# Altium project MB1397.PrjPcb (part 8 of 9)

## Sheet RS232&RS485.SchDoc: RS232 & RS485
size A4; Date: Not used; ApprovedBy: Not used; CheckedBy: Not used; Author: Not used; CompanyName: STMicroelectronics; DrawnBy: Not used; Engineer: Not used; Organization: Not used; Address1: Not used; Address2: Not used; Address3: Not used; Address4: Not used; DocumentNumber: Not used; Revision: Not used; SheetNumber: 11; SheetTotal: 22; CurrentTime: Not used; CurrentDate: Not used; Time: Not used; DocumentFullPathAndName: Not used; DocumentName: Not used; ModifiedDate: Not used; ImagePath: Not used; ProjectName: Not used; Application_BuildNumber: Not used
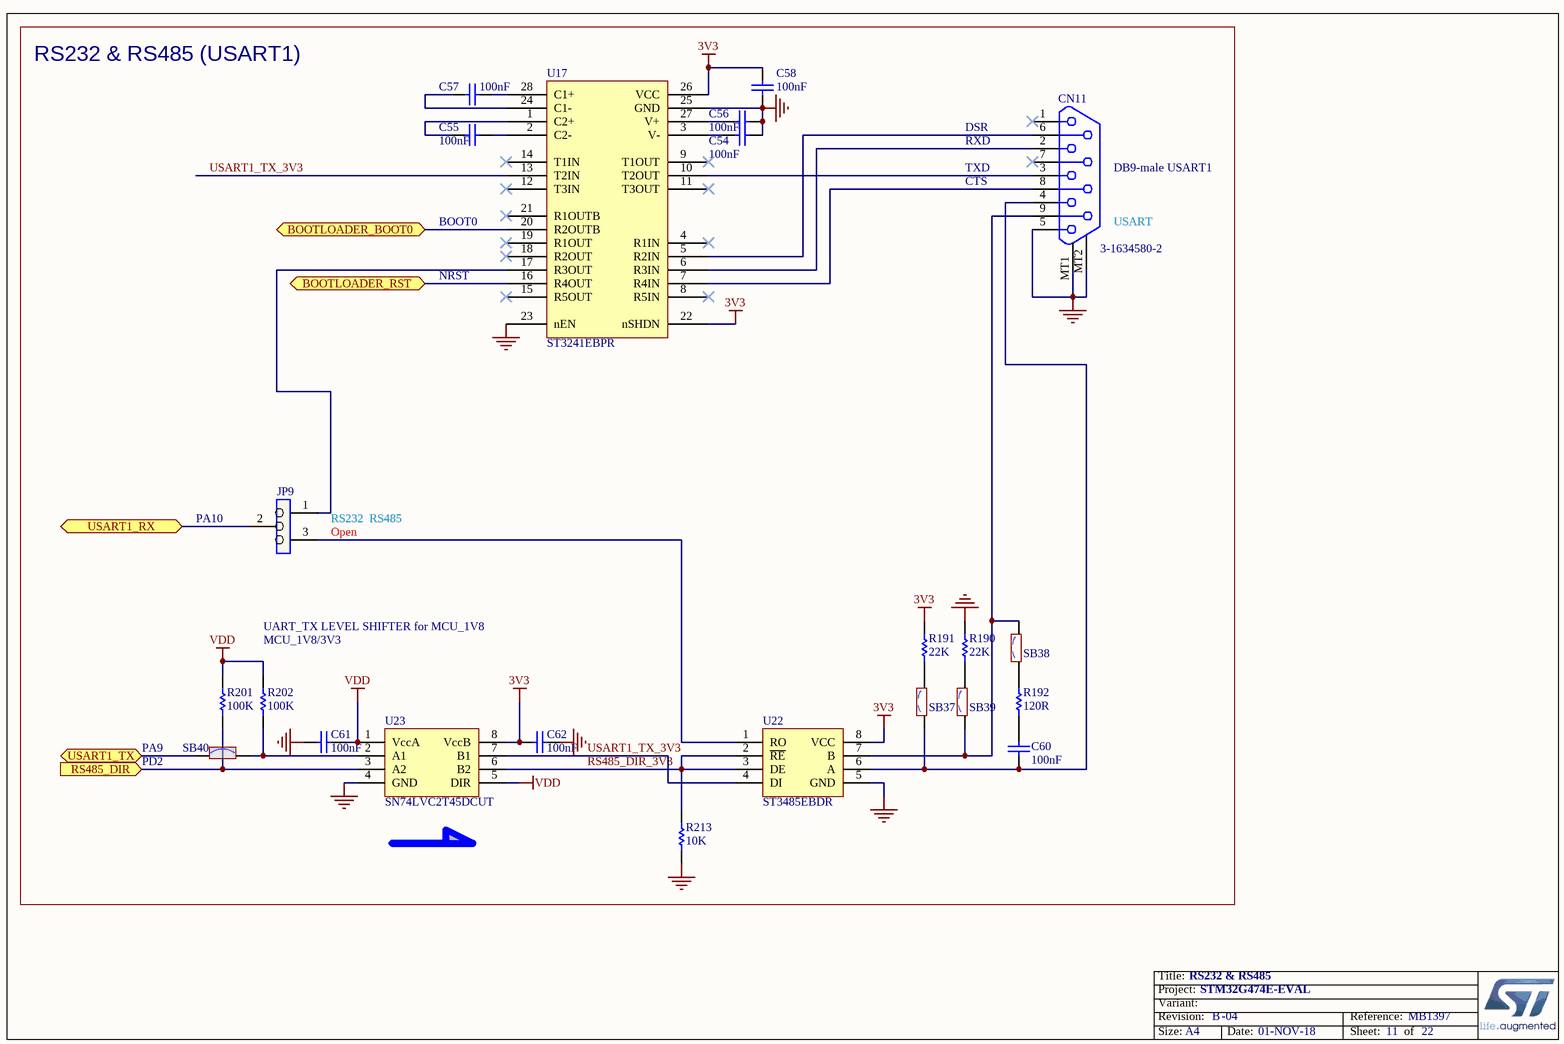
[diagram p20: RS232&RS485.SchDoc]

### Parts
C54  value 100nF  [C0402]  (hidden comment: Capacitor)
C55  value 100nF  [C0402]  (hidden comment: Capacitor)
C56  value 100nF  [C0402]  (hidden comment: Capacitor)
C57  value 100nF  [C0402]  (hidden comment: Capacitor)
C58  value 100nF  [C0402]  (hidden comment: Capacitor)
C60  value 100nF  [C0603]  (hidden comment: Capacitor)
C61  value 100nF  [C0603]  (hidden comment: Capacitor)
C62  value 100nF  [C0603]  (hidden comment: Capacitor)
CN11  value 3-1634580-2  [CON_DB9-MALE_TYCO_3-1634580-2]  (hidden comment: DB9_Header_male_3-1634580-2)
JP9  Jumper_Header 3x1  [CON_SAMTEC_TSW-103-07-F-S]  (value not drawn)
R190  value 22K  [R0603]  (hidden comment: Resistor)
R191  value 22K  [R0603]  (hidden comment: Resistor)
R192  value 120R  [R0603]  (hidden comment: Resistor)
R201  value 100K  [R0603]  (hidden comment: Resistor)
R202  value 100K  [R0603]  (hidden comment: Resistor)
R213  value 10K  [R0603]  (hidden comment: Resistor)
SB37  SB_OFF  [SOLDER-BRIDGE_R0603-0R]  (value not drawn)
SB38  SB_OFF  [SOLDER-BRIDGE_R0603-0R]  (value not drawn)
SB39  SB_OFF  [SOLDER-BRIDGE_R0603-0R]  (value not drawn)
SB40  SB_ON  [SOLDER-BRIDGE_R0603-0R]  (value not drawn)
U17  ST3241EBPR  [ICC_SSOP28_10P2X5P3_P065]
U22  ST3485EBDR  [ICC_SO8_5X4_P127]
U23  SN74LVC2T45DCUT  [ICC_VSSOP8_DCU_R-PDSO-G8_2X2P30_P050]

### Ports
BOOTLOADER_BOOT0, BOOTLOADER_RST, RS485_DIR (in), USART1_RX, USART1_TX

### Nets
3V3: C58.1 C62.2 R191.1 U17.22(nSHDN) U17.26(VCC) U22.8(VCC) U23.8(VccB)
GND: C54.1 C56.1 C58.2 C61.2 C62.1 CN11.5 CN11.MT1 CN11.MT2 R190.2 R213.1 U17.23(nEN) U17.25(GND) U22.5(GND) U23.4(GND)
VDD: C61.1 R201.2 R202.2 U23.1(VccA) U23.5(DIR)
RS485_DIR: R201.1 U23.3(A2) ; port RS485_DIR
RS485_DIR_3V3: R213.2 U22.2(~{RE}) U22.3(DE) U23.6(B2)
USART1_RX: JP9.2 ; port USART1_RX
USART1_TX: SB40.1 ; port USART1_TX
USART1_TX_3V3: U17.13(T2IN) U22.4(DI) U23.7(B1)
NetC54_2: C54.2 U17.3(V-)
NetC55_1: C55.1 U17.1(C2+)
NetC55_2: C55.2 U17.2(C2-)
NetC56_2: C56.2 U17.27(V+)
NetC57_1: C57.1 U17.24(C1-)
NetC57_2: C57.2 U17.28(C1+)
NetC60_1: C60.1 CN11.4 SB37.1 U22.6(A)
NetC60_2: C60.2 R192.1
NetCN11_2: CN11.2 U17.6(R3IN)
NetCN11_3: CN11.3 U17.10(T2OUT)
NetCN11_6: CN11.6 U17.5(R2IN)
NetCN11_8: CN11.8 U17.7(R4IN)
NetCN11_9: CN11.9 SB38.2 SB39.1 U22.7(B)
NetD2_1: U17.20(R2OUTB) ; port BOOTLOADER_BOOT0
NetJP9_1: JP9.1 U17.17(R3OUT)
NetJP9_3: JP9.3 U22.1(RO)
NetJP18_2: U17.16(R4OUT) ; port BOOTLOADER_RST
NetR190_1: R190.1 SB39.2
NetR191_2: R191.2 SB37.2
NetR192_2: R192.2 SB38.1
NetR202_1: R202.1 SB40.2 U23.2(A1)

Not connected (* = marked no-connect by the designer): CN11 1* 7*; U17 4(R1IN)* 8(R5IN)* 9(T1OUT)* 11(T3OUT)* 12(T3IN)* 14(T1IN)* 15(R5OUT)* 18(R2OUT)* 19(R1OUT)* 21(R1OUTB)*

### Notes on the sheet
- RS232 & RS485 (USART1)
- RXD
- TXD
- CTS
- DSR
- (near CN11) DB9-male USART1
- BOOT0
- (near CN11) USART
- NRST
- PA10
- (near JP9) RS232  RS485
- (near JP9) Open
- UART_TX LEVEL SHIFTER for MCU_1V8
- MCU_1V8/3V3
- PA9
- PD2
- Title:
- Project:
- Size:
- Revision:
- Variant:
- A4
- -
- Date:
- Reference:
- Sheet:
- of

### Library data of the parts
C54-C58 = MCD-00006: as C157 on sheet Peripherals; Internal_Part_Number: MCD-00006; ComponentLink1Description: Datasheet; Status: Released; Package: C0402; Part_Type: Capacitor; ComponentLink1URL: http://tunmcdsvn.tun.st.com/Component_Datasheet_Library/Trunk/Capacitors/Yageo_Multilayer_Capacitor_X7R_series_100pF_to_22uF
C60-C62 = MCD-00211: as C13 on sheet Peripherals; Internal_Part_Number: MCD-00211; ComponentLink1Description: Datasheet; Status: Released; Part_Type: Capacitor; Package: C0603; ComponentLink1URL: http://tunmcdsvn.tun.st.com/Component_Datasheet_Library/Trunk/Capacitors/Yageo_Multilayer_Capacitor_X7R_series_100pF_to_22uF
CN11 = MCD-00127: Header, DB9, RA, TH, Height 13.57mm; Manufacturer: TYCO; Part_Type: Connector; Provided_By: SUBCO; Initial_Board_Reference: MB1262; Path: ws/MCD_ApplicationBoards/Lists/MCDPARTSdatabase; Item Type: Item; Internal_Part_Number: MCD-00127; Manufacturer_Part_Number: 3-1634580-2; ComponentLink1Description: Datasheet; Status: Released; ComponentLink1URL: http://tunmcdsvn.tun.st.com/Component_Datasheet_Library/Trunk/Connectors/Tyco_DB9_3-1634580-2_footprint
JP9 = MCD-00111: as JP14 on sheet USB_PD; Internal_Part_Number: MCD-00111; Value: Header 3x1; Status: Released; ComponentLink1Description: Datasheet; ComponentLink1URL: http://tunmcdsvn.tun.st.com/Component_Datasheet_Library/Trunk/Connectors/Samtec_TSW-HTSW-series
R190 R191 = MCD-00430: Resistor,22K,0603,1%,1/10W; Manufacturer_Part_Number: RC0603FR-0722KL; Manufacturer: YAGEO; Provided_By: SUBCO; Initial_Board_Reference: MBxxxx; Path: ws/MCD_ApplicationBoards/Lists/MCDPARTSdatabase; Item Type: Item; Internal_Part_Number: MCD-00430; Status: Released; Part_Type: Resistor; Package: R0603; ComponentLink1Description: Datasheet; ComponentLink1URL: http://tunmcdsvn.tun.st.com/Component_Datasheet_Library/Trunk/Resistors/Yageo_Resistor_RC0603-series
R192 = MCD-00338: Resistor,120R,0603,1%,1/10W; Manufacturer_Part_Number: RC0603FR-07120RL; Manufacturer: YAGEO; BMS_Part_Number: 9129734; Provided_By: SUBCO; Initial_Board_Reference: MBxxxx; Path: ws/MCD_ApplicationBoards/Lists/MCDPARTSdatabase; Item Type: Item; Internal_Part_Number: MCD-00338; Status: Released; Part_Type: Resistor; Package: R0603; ComponentLink1Description: Datasheet; ComponentLink1URL: http://tunmcdsvn.tun.st.com/Component_Datasheet_Library/Trunk/Resistors/Yageo_Resistor_RC0603-series
R201 R202 = MCD-00223: as R215 on sheet STLink_V3E_SWD; Internal_Part_Number: MCD-00223; Status: Released; Part_Type: Resistor; Package: R0603; ComponentLink1Description: Datasheet; ComponentLink1URL: http://tunmcdsvn.tun.st.com/Component_Datasheet_Library/Trunk/Resistors/Yageo_Resistor_RC0603-series
R213 = MCD-00220: as R176 on sheet Peripherals; Internal_Part_Number: MCD-00220; Status: Released; Part_Type: Resistor; Package: R0603; ComponentLink1Description: Datasheet; ComponentLink1URL: http://tunmcdsvn.tun.st.com/Component_Datasheet_Library/Trunk/Resistors/Yageo_Resistor_RC0603-series
SB37-SB39 = MCD-00072: as SB81 on sheet ExtensionConnector; Internal_Part_Number: MCD-00072; Status: Released; ComponentLink1Description: Datasheet; Package: SB0603; ComponentLink1URL: http://tunmcdsvn.tun.st.com/Component_Datasheet_Library/Trunk/Resistors/Yageo_Resistor_RC0603-series
SB40 = MCD-00071: as SB1 on sheet Peripherals; Internal_Part_Number: MCD-00071; Status: Released; ComponentLink1Description: Datasheet; Package: SB0603; ComponentLink1URL: http://tunmcdsvn.tun.st.com/Component_Datasheet_Library/Trunk/Resistors/Yageo_Resistor_RC0603-series
U17 = MCD-00152: RS-232 transceiver with auto-power-down; Part_Type: IC; Manufacturer: STMICROELECTRONICS; BMS_Part_Number: 9176312; Provided_By: SUBCO with ST control; Initial_Board_Reference: MB1262; Path: ws/MCD_ApplicationBoards/Lists/MCDPARTSdatabase; Item Type: Item; Internal_Part_Number: MCD-00152; Value: ST3241EBPR; Status: Released; Manufacturer_Part_Number: ST3241EBPR; ComponentLink1Description: Datasheet; ComponentLink1URL: http://tunmcdsvn.tun.st.com/Component_Datasheet_Library/Trunk/IC/STM_RS232 transceiver_ST3241Ex
U22 = MCD-01160: RS-485/RS-422 transceiver Up to 12Mbps; Part_Type: IC; Manufacturer: STMICROELECTRONICS; BMS_Part_Number: 9172020; Provided_By: SUBCO with ST control; Internal_Part_Number: MCD-01160; Value: ST3485EBDR; Status: Checked; Manufacturer_Part_Number: ST3485EBDR; ComponentLink1Description: Datasheet; ComponentLink1URL: http://tunmcdsvn.tun.st.com/Component_Datasheet_Library/Trunk/IC/STM_RS485 transceiver_ST3485Ex
U23 = MCD-00264: Dual bit dual supply bus transceiver; Part_Type: IC; Manufacturer: TEXAS INSTRUMENTS; Provided_By: SUBCO; Initial_Board_Reference: MB1319; Path: ws/MCD_ApplicationBoards/Lists/MCDPARTSdatabase; Item Type: Item; Internal_Part_Number: MCD-00264; Value: SN74LVC2T45DCUT; Status: Released; Manufacturer_Part_Number: SN74LVC2T45DCUT; ComponentLink1Description: Datasheet; ComponentLink1URL: http://tunmcdsvn.tun.st.com/Component_Datasheet_Library/Trunk/IC/TI_Dual_bit_tranceiver_SN74LVC2T45